# Altium schematic sheet ICSL_PS_POWER.SchDoc
size 381 x 241 mm
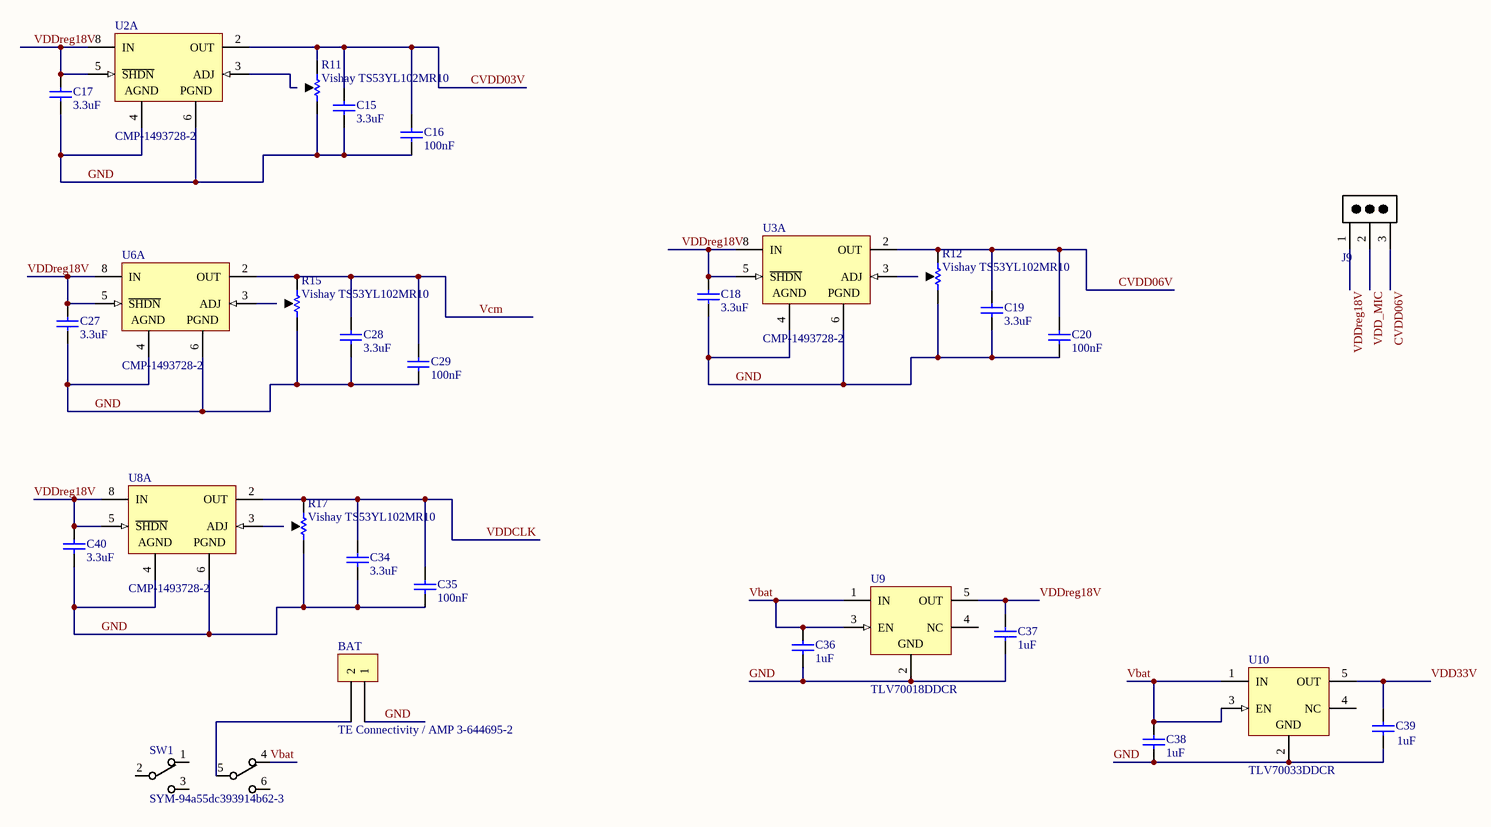
[diagram p0: ICSL_PS_POWER.SchDoc]

## Parts
BAT  TE Connectivity / AMP 3-644695-2  [PCB-i8m17woc8q0u0fbeoczf-1]
C15  3.3uF
C16  100nF  [CAPC1608X90X35NL15T15]
C17  3.3uF
C18  3.3uF
C19  3.3uF  [CAPC2013X94X50LL20T25]
C20  100nF  [CAPC1608X90X35NL15T15]
C27  3.3uF  [CAPC2013X94X50LL20T25]
C28  3.3uF  [CAPC2013X94X50LL20T25]
C29  100nF  [CAPC1608X90X35NL15T15]
C34  3.3uF  [CAPC2013X94X50LL20T25]
C35  100nF  [CAPC1608X90X35NL15T15]
C36  1uF  [CAPC2013X94X50LL20T25]
C37  1uF  [CAPC2013X94X50LL20T25]
C38  1uF  [CAPC2013X94X50LL20T25]
C39  1uF  [CAPC2013X94X50LL20T25]
C40  3.3uF  [CAPC2013X94X50LL20T25]
J9  3M 961103-6404-AR  [JP2]  (value not drawn)
R11  Vishay TS53YL102MR10  [PCB-2411124-1]
R12  Vishay TS53YL102MR10  [PCB-2411124-1]
R15  Vishay TS53YL102MR10  [PCB-2411124-1]
R17  Vishay TS53YL102MR10  [PCB-2411124-1]
SW1  SYM-94a55dc393914b62-3  [PCB-ixy6r264hz8u4okoxsrw-1]
U2  CMP-1493728-2  [LT-S8-8_N]  (part A of 2)
U3  CMP-1493728-2  [LT-S8-8_N]  (part A of 2)
U6  CMP-1493728-2  [LT-S8-8_N]  (part A of 2)
U8  CMP-1493728-2  [LT-S8-8_N]  (part A of 2)
U9  TLV70018DDCR  [TI-DDC5_L]
U10  TLV70033DDCR  [PCB-o8wu4fpdtd8bqe2xojjk-1]

## Nets
CVDD03V: C15.2 C16.1 R11.1 U2.2(OUT)
CVDD06V: C19.2 C20.1 J9.3 R12.1 U3.2(OUT)
GND: BAT.1 C15.1 C16.2 C17.1 C18.1 C19.1 C20.2 C27.1 C28.1 C29.1 C34.1 C35.1 C36.1 C37.1 C38.1 C39.2 C40.1 R11.3 R12.3 R15.3 R17.3 U2.4(AGND) U2.6(PGND) U3.4(AGND) U3.6(PGND) U6.4(AGND) U6.6(PGND) U8.4(AGND) U8.6(PGND) U9.2(GND) U10.2(GND)
Vbat: C36.2 C38.2 SW1.4 U9.1(IN) U9.3(EN) U10.1(IN) U10.3(EN)
Vcm: C28.2 C29.2 R15.1 U6.2(OUT)
VDD33V: C39.1 U10.5(OUT)
VDD_MIC: J9.2
VDDCLK: C34.2 C35.2 R17.1 U8.2(OUT)
VDDreg18V: C17.2 C18.2 C27.2 C37.2 C40.2 J9.1 U2.5(~{SHDN}) U2.8(IN) U3.5(~{SHDN}) U3.8(IN) U6.5(~{SHDN}) U6.8(IN) U8.5(~{SHDN}) U8.8(IN) U9.5(OUT)
NetBAT_2: BAT.2 SW1.5
NetR11_2: R11.2 U2.3(ADJ)
NetR12_2: R12.2 U3.3(ADJ)
NetR15_2: R15.2 U6.3(ADJ)
NetR17_2: R17.2 U8.3(ADJ)

Not connected (* = marked no-connect by the designer): SW1 1 2 3 6; U9 4(NC); U10 4(NC)

## Library data of the parts
BAT = CMP-2792ecc2f21af855-6: Connector Unshrouded Header 2 Position 2.54mm Solder Straight Thru-Hole; Voltage Rating (AC): 250 V; Number of Positions: 2; Mounting Angle: 180 °; Lead-Free Status: Lead Free; Shrouded: No; ELV Compliant: Compliant; Gender: Male; Flammability Rating: UL 94 V-0; Number of Rows: 1; Housing Color: Natural; Size-Width: 2.34 mm; Mounting Style: Through Hole; Orientation: Vertical; Lifecycle Status: Active; Manufacturer Part Number: 3-644695-2; OctopartID: 2792ecc2f21af855; RoHS: Compliant; Pin Pitch: 2.54 mm; Contact Plating: Tin; Housing Material: Polyester; Size-Length: 4.80 mm; Contact Material: Copper Alloy; Size-Height: 2.54 mm; Number of Contacts: 2; Packaging: Box, Bag; Octopart URL: http://octopart.com/3-644695-2-te+connectivity+%2F+amp-39514350
C15 C17 C18 = CMP-126016-2: CAP CER 1500PF 50V 10% X7R 0805; Manufacturer Part Number: 08055C152KAT2A; Capacitance: 1.5e-09 F; Case/Package (SI): 2012; Lead-Free Status: Lead Free; Voltage Rating (DC): 50.0 V; Capacitance Tolerance: ±10%; Case/Package: 0805; Dielectric Characteristic: X7R; Mounting Style: Surface Mount; Number of Pins: 2; Octopart Url: https://octopart.com/08055c152kat2a-avx+interconnect+%2F+elco-40100580; OctopartID: c94f02260ecd1688; Packaging: Cut Tape (CT); REACH SVHC Compliance: No SVHC; RoHS: Compliant; Size-Height: 0.00071 m; Size-Length: 0.00201 m; Size-Width: 0.00125 m
C16 C20 C29 C35 = CMP-4105021-1: Multilayer Ceramic Capacitors MLCC - SMD/SMT 0603 10uF 4VOLTS X5R 10%; Manufacturer Part Number: 06034D106KAT2A; Capacitance: .1 uF; Temperature Coefficient / Code: +/- 15 %; Case Width: 0.81 mm; Voltage Rating DC: 4 V; Brand: AVX; Case Length: 1.6 mm; Type: Commercial Surface Mount Chip; Case Height: 0.9 mm; Dimensions: 0.81 mm W x 1.6 mm L x 0.9 mm H; Termination Style: SMD/SMT; Dielectric: X5R; RoHS: Details; Factory Pack Quantity: 3000; Ciiva URL: https://ciiva.com/part/06034d106kat2a-4105021; Operating Temperature Range: - 55 C to + 85 C; Case Code - mm: 1608; Case Code - in: 0603; Tolerance: 10 %; Voltage Rating: 4 V; Manufacturer: AVX; Minimum Operating Temperature: - 55 C; Product Category: Multilayer Ceramic Capacitors MLCC - SMD/SMT; Maximum Operating Temperature: + 85 C; Package / Case: 0603 (1608 metric); Product: General Type MLCCs; Packaging: Reel; CiivaID: 4105021
C19 C27 C28 C34 C36-C40 = CMP-126016-2: CAP CER 1500PF 50V 10% X7R 0805; Capacitance: 1.5e-09 F; Case/Package (SI): 2012; Lead-Free Status: Lead Free; Voltage Rating (DC): 50.0 V; Capacitance Tolerance: ±10%; Case/Package: 0805; Dielectric Characteristic: X7R; Mounting Style: Surface Mount; Number of Pins: 2; Octopart Url: https://octopart.com/08055c152kat2a-avx+interconnect+%2F+elco-40100580; OctopartID: c94f02260ecd1688; Packaging: Cut Tape (CT); REACH SVHC Compliance: No SVHC; RoHS: Compliant; Size-Height: 0.00071 m; Size-Length: 0.00201 m; Size-Width: 0.00125 m
J9 = 961103-6404-AR: CONN HEADER VERT SGL 3POS GOLD; Number of Contacts: 3; Gender: Male; Mounting Style: Through Hole; Contact Plating: Gold; Octopart Url: https://octopart.com/961103-6404-ar-3m-14400730; OctopartID: 3fbff66ea603e078; Contact Material: Copper Alloy; RoHS: Compliant
R11 = TS53YL102MR10: TRIMMER 1K OHM 0.25W SMD
R12 R15 R17 = CMP-2411124-3: TRIMMER 1K OHM 0.25W SMD
SW1 = JS202011SCQN: Slide Switch DPDT Surface Mount; Manufacturer: C&K; Vendor Part Number: 401-2002-1-ND; HelpURL: http://www.ckswitches.com/media/1422/js.pdf; Operating Temperature: -40°C ~ 85°C
U2 U3 U6 U8 = CMP-1493728-2: Low 160 mV Dropout Voltage, Internal PNP Pass Element, 200 mV Reference Voltage, 0.9 to 10 V Vin, Adjustable Vout, 8-pin SOIC (S8-8), -40 to 125 degC, Pb-Free; Dropout Voltage: 0.155 V; Lead-Free Status: Lead Free; Number of Outputs: 1; Output Current: 0.5 A; Mounting Style: Surface Mount; Number of Pins: 8; Octopart Url: https://octopart.com/lt3021es8%23pbf-linear+technology-2716766; OctopartID: 77c5bee626fda802; REACH SVHC Compliance: No SVHC; RoHS: Compliant
U9 = TLV70018DDCR: Single Output LDO, 200 mA, Fixed 1.8 V Output, 2 to 5.5 V Input, with Low IQ, 5-pin SOT (DDC), -40 to 125 degC, Green (RoHS & no Sb/Br); Dropout Voltage: 0.175 V; Lead-Free Status: Lead Free; Number of Regulated Outputs: 1; Output Capacitor Type: Ceramic; Output Current: 0.2 A; Quiescent Current: 3e-05 A; Lifecycle Status: Active; Number of Pins: 5; Octopart Url: https://octopart.com/tlv70018ddcr-texas+instruments-12195704; OctopartID: 0919c0a93b07d6de; REACH SVHC Compliance: No SVHC; RoHS: Compliant
U10 = TLV70033DDCR: Single Output LDO, 200 mA, Fixed 3.3 V Output, 2 to 5.5 V Input, with Low IQ, 5-pin SOT (DDC), -40 to 125 degC, Green (RoHS & no Sb/Br); Number of Regulated Outputs: 1; Dropout Voltage: 0.175 V; Output Current: 0.2 A; Quiescent Current: 3e-05 A; Output Capacitor Type: Ceramic; Lead-Free Status: Lead Free; OctopartID: 68e6a1564b0cb721; Packaging: Tape & Reel (TR); Number of Pins: 5; Octopart Url: https://octopart.com/tlv70033ddcr-texas+instruments-12191372; Lifecycle Status: Active; RoHS: Compliant